# Altium schematic sheet 30_Power1.SchDoc: Board power supply 1
size A3; Organization: Lime Microsystems; Address1: Surrey Tech Centre; Address2: Guildford GU2 7YG; Address3: Surrey; Address4: United Kingdom; Revision: v1.1; SheetNumber: 30; SheetTotal: 31
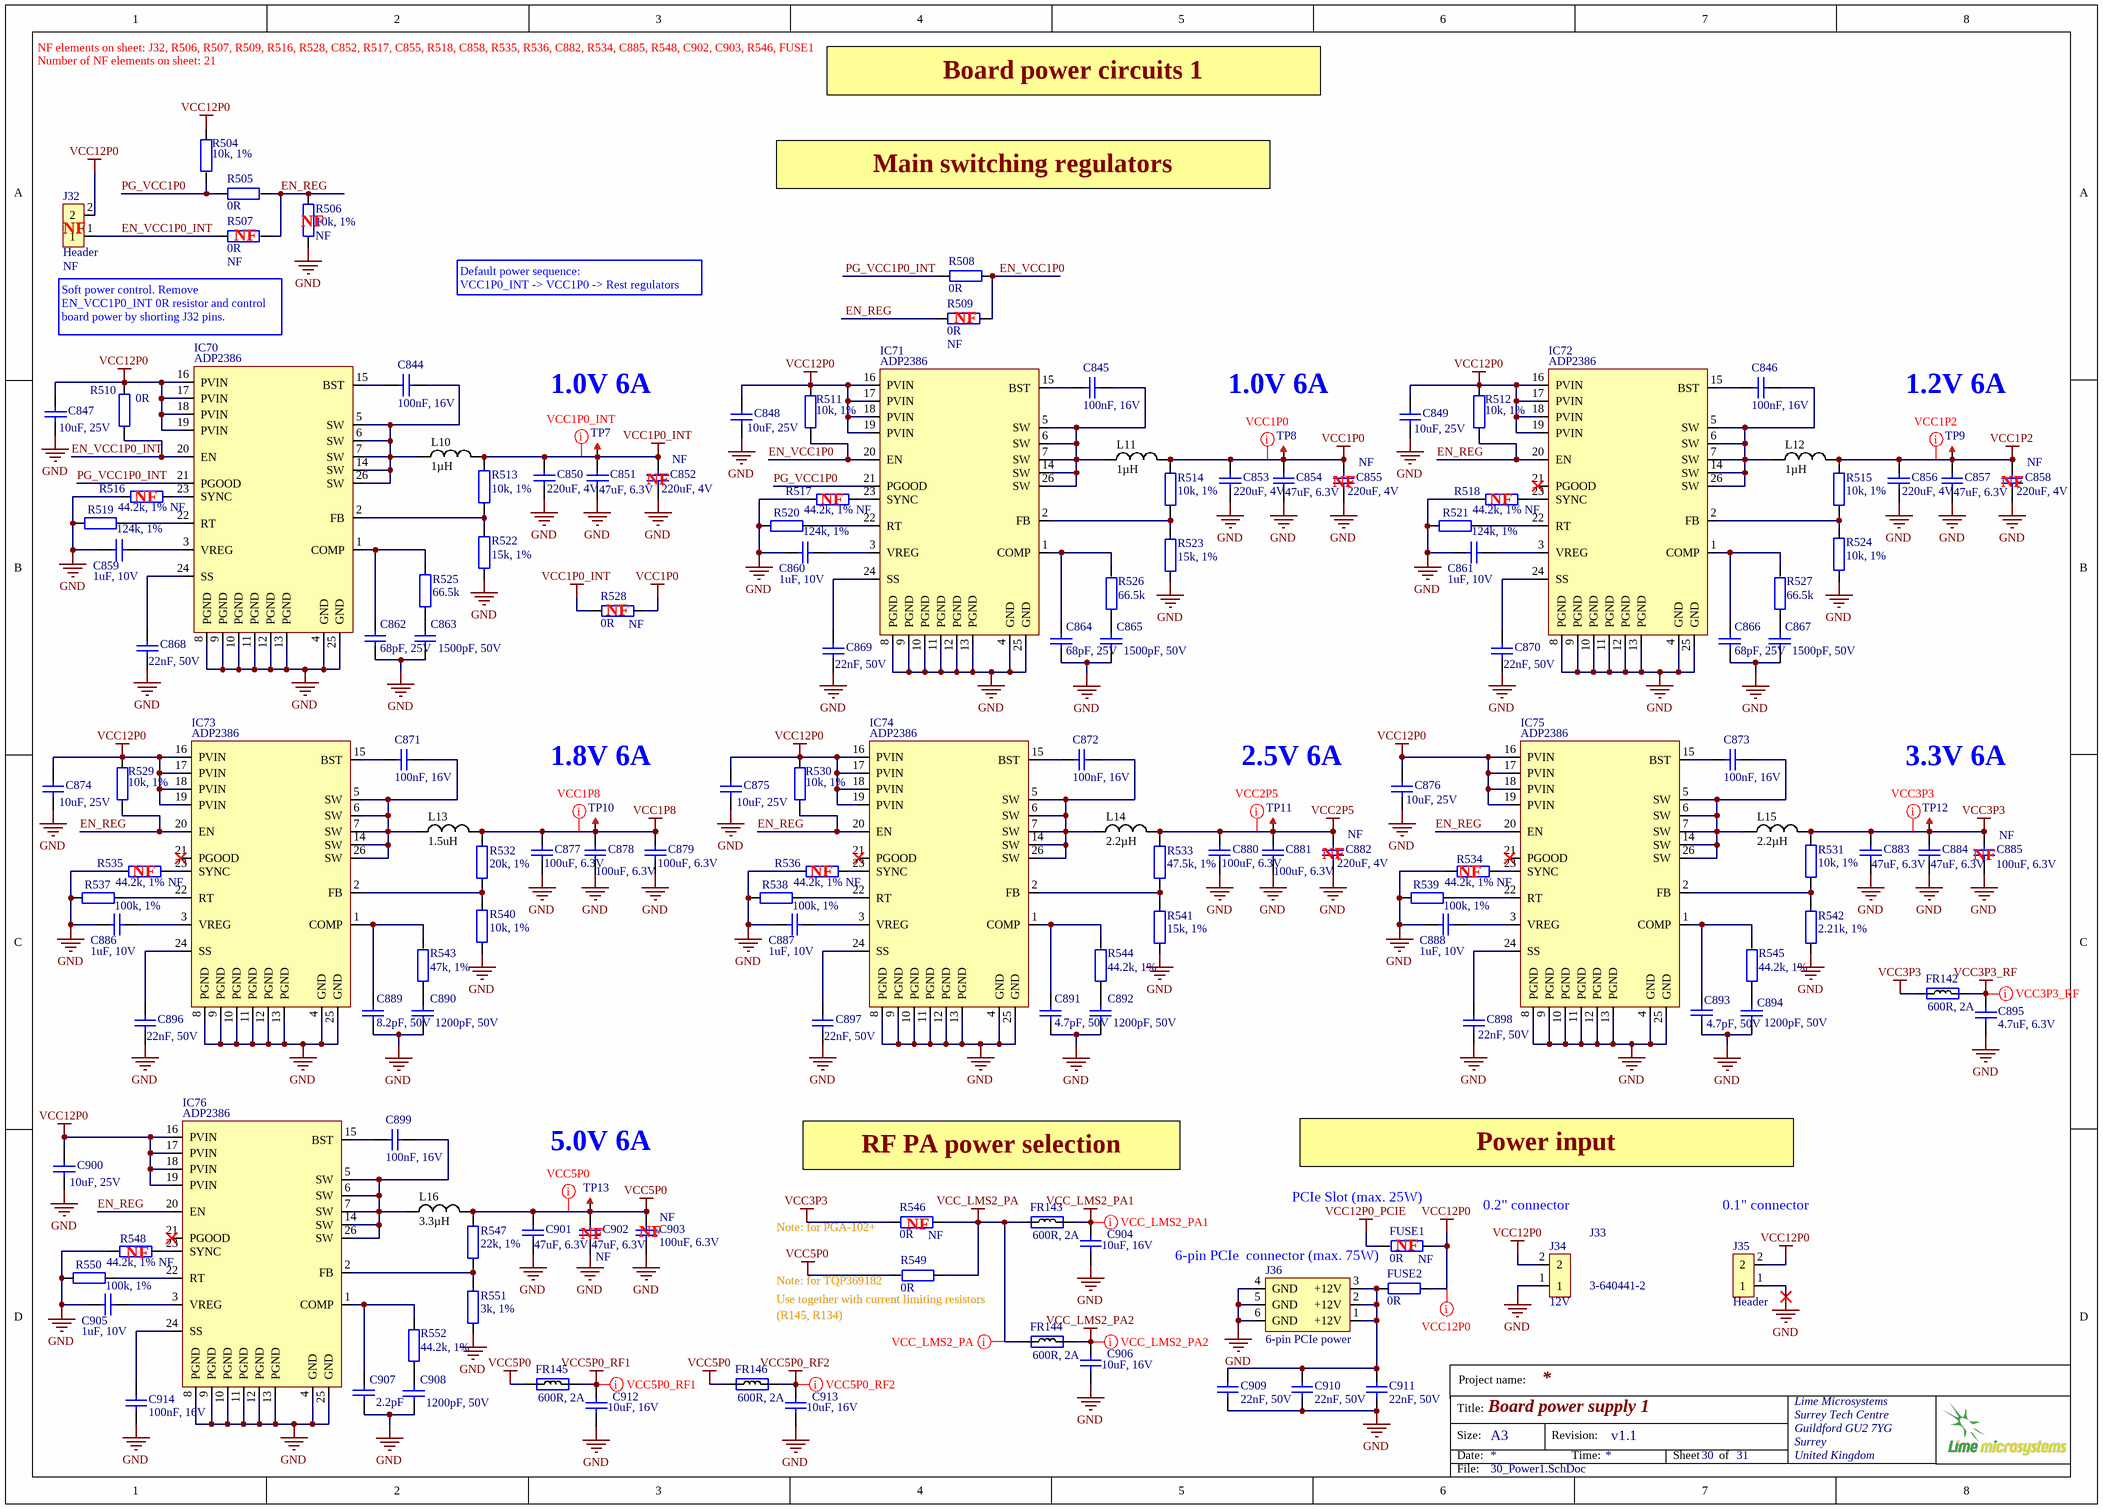
[diagram p0: 30_Power1.SchDoc]

## Parts
C844  100nF, 16V  [CAP0402]
C845  100nF, 16V  [CAP0402]
C846  100nF, 16V  [CAP0402]
C847  10uF, 25V  [CAP0805]
C848  10uF, 25V  [CAP0805]
C849  10uF, 25V  [CAP0805]
C850  220uF, 4V  [CAP1206]
C851  47uF, 6.3V  [CAP1206]
C852  220uF, 4V  Assembly Info: NF  [CAP1206]
C853  220uF, 4V  [CAP1206]
C854  47uF, 6.3V  [CAP1206]
C855  220uF, 4V  Assembly Info: NF  [CAP1206]
C856  220uF, 4V  [CAP1206]
C857  47uF, 6.3V  [CAP1206]
C858  220uF, 4V  Assembly Info: NF  [CAP1206]
C859  1uF, 10V  [CAP0402]
C860  1uF, 10V  [CAP0402]
C861  1uF, 10V  [CAP0402]
C862  68pF, 25V  [CAP0402]
C863  1500pF, 50V  [CAP0402]
C864  68pF, 25V  [CAP0402]
C865  1500pF, 50V  [CAP0402]
C866  68pF, 25V  [CAP0402]
C867  1500pF, 50V  [CAP0402]
C868  22nF, 50V  [CAP0402]
C869  22nF, 50V  [CAP0402]
C870  22nF, 50V  [CAP0402]
C871  100nF, 16V  [CAP0402]
C872  100nF, 16V  [CAP0402]
C873  100nF, 16V  [CAP0402]
C874  10uF, 25V  [CAP0805]
C875  10uF, 25V  [CAP0805]
C876  10uF, 25V  [CAP0805]
C877  100uF, 6.3V  [CAP1206]
C878  100uF, 6.3V  [CAP1206]
C879  100uF, 6.3V  [CAP1206]
C880  100uF, 6.3V  [CAP1206]
C881  100uF, 6.3V  [CAP1206]
C882  220uF, 4V  Assembly Info: NF  [CAP1206]
C883  47uF, 6.3V  [CAP1206]
C884  47uF, 6.3V  [CAP1206]
C885  100uF, 6.3V  Assembly Info: NF  [CAP1206]
C886  1uF, 10V  [CAP0402]
C887  1uF, 10V  [CAP0402]
C888  1uF, 10V  [CAP0402]
C889  8.2pF, 50V  [CAP0402]
C890  1200pF, 50V  [CAP0402]
C891  4.7pF, 50V  [CAP0402]
C892  1200pF, 50V  [CAP0402]
C893  4.7pF, 50V  [CAP0402]
C894  1200pF, 50V  [CAP0402]
C895  4.7uF, 6.3V  [CAP0402]
C896  22nF, 50V  [CAP0402]
C897  22nF, 50V  [CAP0402]
C898  22nF, 50V  [CAP0402]
C899  100nF, 16V  [CAP0402]
C900  10uF, 25V  [CAP0805]
C901  47uF, 6.3V  [CAP1206]
C902  47uF, 6.3V  Assembly Info: NF  [CAP1206]
C903  100uF, 6.3V  Assembly Info: NF  [CAP1206]
C904  10uF, 16V  [CAP0603]
C905  1uF, 10V  [CAP0402]
C906  10uF, 16V  [CAP0603]
C907  2.2pF  [CAP0402]
C908  1200pF, 50V  [CAP0402]
C909  22nF, 50V  [CAP0402]
C910  22nF, 50V  [CAP0402]
C911  22nF, 50V  [CAP0402]
C912  10uF, 16V  [CAP0603]
C913  10uF, 16V  [CAP0603]
C914  100nF, 16V  [CAP0402]
FR142  600R, 2A  [RES0805]
FR143  600R, 2A  [RES0805]
FR144  600R, 2A  [RES0805]
FR145  600R, 2A  [RES0805]
FR146  600R, 2A  [RES0805]
FUSE1  0R  Assembly Info: NF  [RES0805]
FUSE2  0R  [RES0805]
IC70  ADP2386  [ADP2386]
IC71  ADP2386  [ADP2386]
IC72  ADP2386  [ADP2386]
IC73  ADP2386  [ADP2386]
IC74  ADP2386  [ADP2386]
IC75  ADP2386  [ADP2386]
IC76  ADP2386  [ADP2386]
J32  Header  Assembly Info: NF  [HDR_1x2]
J33  3-640441-2  (mechanical)
J34  12V  [1744037-2_CONNECTOR_1X2]
J35  Header  [HDR_1x2]
J36  6-pin PCIe power  [PCIe_POWER_HEADER_6PIN]
L10  1µH  [FDVE1040_TOKO_INDUCTOR]
L11  1µH  [FDVE1040_TOKO_INDUCTOR]
L12  1µH  [FDVE1040_TOKO_INDUCTOR]
L13  1.5uH  [FDVE1040_TOKO_INDUCTOR]
L14  2.2µH  [FDVE1040_TOKO_INDUCTOR]
L15  2.2µH  [FDVE1040_TOKO_INDUCTOR]
L16  3.3µH  [FDVE1040_TOKO_INDUCTOR]
R504  10k, 1%  [RES0402]
R505  0R  [RES0402]
R506  10k, 1%  Assembly Info: NF  [RES0402]
R507  0R  Assembly Info: NF  [RES0402]
R508  0R  [RES0402]
R509  0R  Assembly Info: NF  [RES0402]
R510  0R  [RES0402]
R511  10k, 1%  [RES0402]
R512  10k, 1%  [RES0402]
R513  10k, 1%  [RES0402]
R514  10k, 1%  [RES0402]
R515  10k, 1%  [RES0402]
R516  44.2k, 1%  Assembly Info: NF  [RES0402]
R517  44.2k, 1%  Assembly Info: NF  [RES0402]
R518  44.2k, 1%  Assembly Info: NF  [RES0402]
R519  124k, 1%  [RES0402]
R520  124k, 1%  [RES0402]
R521  124k, 1%  [RES0402]
R522  15k, 1%  [RES0402]
R523  15k, 1%  [RES0402]
R524  10k, 1%  [RES0402]
R525  66.5k  [RES0402]
R526  66.5k  [RES0402]
R527  66.5k  [RES0402]
R528  0R  Assembly Info: NF  [RES0805]
R529  10k, 1%  [RES0402]
R530  10k, 1%  [RES0402]
R531  10k, 1%  [RES0402]
R532  20k, 1%  [RES0402]
R533  47.5k, 1%  [RES0402]
R534  44.2k, 1%  Assembly Info: NF  [RES0402]
R535  44.2k, 1%  Assembly Info: NF  [RES0402]
R536  44.2k, 1%  Assembly Info: NF  [RES0402]
R537  100k, 1%  [RES0402]
R538  100k, 1%  [RES0402]
R539  100k, 1%  [RES0402]
R540  10k, 1%  [RES0402]
R541  15k, 1%  [RES0402]
R542  2.21k, 1%  [RES0402]
R543  47k, 1%  [RES0402]
R544  44.2k, 1%  [RES0402]
R545  44.2k, 1%  [RES0402]
R546  0R  Assembly Info: NF  [RES0805]
R547  22k, 1%  [RES0402]
R548  44.2k, 1%  Assembly Info: NF  [RES0402]
R549  0R  [RES0805]
R550  100k, 1%  [RES0402]
R551  3k, 1%  [RES0402]
R552  44.2k, 1%  [RES0402]
TP7  TESTPOINT_PAD  [TP_PAD_1p5MM]  (value not drawn)  (no BOM)
TP8  TESTPOINT_PAD  [TP_PAD_1p5MM]  (value not drawn)  (no BOM)
TP9  TESTPOINT_PAD  [TP_PAD_1p5MM]  (value not drawn)  (no BOM)
TP10  TESTPOINT_PAD  [TP_PAD_1p5MM]  (value not drawn)  (no BOM)
TP11  TESTPOINT_PAD  [TP_PAD_1p5MM]  (value not drawn)  (no BOM)
TP12  TESTPOINT_PAD  [TP_PAD_1p5MM]  (value not drawn)  (no BOM)
TP13  TESTPOINT_PAD  [TP_PAD_1p5MM]  (value not drawn)  (no BOM)

## Nets
GND: C847.1 C848.1 C849.1 C850.1 C851.1 C852.1 C853.1 C854.1 C855.1 C856.1 C857.1 C858.1 C859.2 C860.2 C861.2 C862.2 C863.2 C864.2 C865.2 C866.2 C867.2 C868.2 C869.2 C870.2 C874.1 C875.1 C876.1 C877.1 C878.1 C879.1 C880.1 C881.1 C882.1 C883.1 C884.1 C885.1 C886.2 C887.2 C888.2 C889.2 C890.2 C891.2 C892.2 C893.2 C894.2 C895.1 C896.2 C897.2 C898.2 C900.1 C901.1 C902.1 C903.1 C904.1 C905.2 C906.1 C907.2 C908.2 C909.2 C910.2 C911.2 C912.1 C913.1 C914.1 IC70.4(GND) IC70.8(PGND) IC70.9(PGND) IC70.10(PGND) IC70.11(PGND) IC70.12(PGND) IC70.13(PGND) IC70.25(GND) IC71.4(GND) IC71.8(PGND) IC71.9(PGND) IC71.10(PGND) IC71.11(PGND) IC71.12(PGND) IC71.13(PGND) IC71.25(GND) IC72.4(GND) IC72.8(PGND) IC72.9(PGND) IC72.10(PGND) IC72.11(PGND) IC72.12(PGND) IC72.13(PGND) IC72.25(GND) IC73.4(GND) IC73.8(PGND) IC73.9(PGND) IC73.10(PGND) IC73.11(PGND) IC73.12(PGND) IC73.13(PGND) IC73.25(GND) IC74.4(GND) IC74.8(PGND) IC74.9(PGND) IC74.10(PGND) IC74.11(PGND) IC74.12(PGND) IC74.13(PGND) IC74.25(GND) IC75.4(GND) IC75.8(PGND) IC75.9(PGND) IC75.10(PGND) IC75.11(PGND) IC75.12(PGND) IC75.13(PGND) IC75.25(GND) IC76.4(GND) IC76.8(PGND) IC76.9(PGND) IC76.10(PGND) IC76.11(PGND) IC76.12(PGND) IC76.13(PGND) IC76.25(GND) J34.1 J35.1 J36.4(GND) J36.5(GND) J36.6(GND) R506.2 R516.2 R517.2 R518.2 R519.2 R520.2 R521.2 R522.1 R523.1 R524.2 R534.2 R535.2 R536.2 R537.2 R538.2 R539.2 R540.2 R541.1 R542.1 R548.2 R550.2 R551.1
VCC1P0: C853.2 C854.2 C855.2 L11.2 R514.1 R528.1 TP8.1
VCC1P0_INT: C850.2 C851.2 C852.2 L10.2 R513.1 R528.2 TP7.1
VCC1P2: C856.2 C857.2 C858.2 L12.2 R515.1 TP9.1
VCC1P8: C877.2 C878.2 C879.2 L13.2 R532.2 TP10.1
VCC2P5: C880.2 C881.2 C882.2 L14.2 R533.2 TP11.1
VCC3P3: C883.2 C884.2 C885.2 FR142.1 L15.2 R531.1 R546.2 TP12.1
VCC3P3_RF: C895.2 FR142.2
VCC5P0: C901.2 C902.2 C903.2 FR145.1 FR146.1 L16.2 R547.2 R549.2 TP13.1
VCC5P0_RF1: C912.2 FR145.2
VCC5P0_RF2: C913.2 FR146.2
VCC12P0: C847.2 C848.2 C849.2 C874.2 C875.2 C876.2 C900.2 FUSE1.1 FUSE2.1 IC70.16(PVIN) IC70.17(PVIN) IC70.18(PVIN) IC70.19(PVIN) IC71.16(PVIN) IC71.17(PVIN) IC71.18(PVIN) IC71.19(PVIN) IC72.16(PVIN) IC72.17(PVIN) IC72.18(PVIN) IC72.19(PVIN) IC73.16(PVIN) IC73.17(PVIN) IC73.18(PVIN) IC73.19(PVIN) IC74.16(PVIN) IC74.17(PVIN) IC74.18(PVIN) IC74.19(PVIN) IC75.16(PVIN) IC75.17(PVIN) IC75.18(PVIN) IC75.19(PVIN) IC76.16(PVIN) IC76.17(PVIN) IC76.18(PVIN) IC76.19(PVIN) J32.2 J34.2 J35.2 R504.1 R510.2 R511.1 R512.1 R529.1 R530.1
VCC12P0_PCIE: FUSE1.2
VCC_LMS2_PA: FR143.1 FR144.1 R546.1 R549.1
VCC_LMS2_PA1: C904.2 FR143.2
VCC_LMS2_PA2: C906.2 FR144.2
EN_REG: IC72.20(EN) IC73.20(EN) IC74.20(EN) IC75.20(EN) IC76.20(EN) R505.2 R506.1 R507.2 R509.1 R512.2 R529.2 R530.2
EN_VCC1P0: IC71.20(EN) R508.1 R509.2 R511.2
EN_VCC1P0_INT: IC70.20(EN) J32.1 R507.1 R510.1
PG_VCC1P0: IC71.21(PGOOD) R504.2 R505.1
PG_VCC1P0_INT: IC70.21(PGOOD) R508.2
NetC844_1: C844.1 IC70.15(BST)
NetC844_2: C844.2 IC70.5(SW) IC70.6(SW) IC70.7(SW) IC70.14(SW) IC70.26(SW) L10.1
NetC845_1: C845.1 IC71.15(BST)
NetC845_2: C845.2 IC71.5(SW) IC71.6(SW) IC71.7(SW) IC71.14(SW) IC71.26(SW) L11.1
NetC846_1: C846.1 IC72.15(BST)
NetC846_2: C846.2 IC72.5(SW) IC72.6(SW) IC72.7(SW) IC72.14(SW) IC72.26(SW) L12.1
NetC859_1: C859.1 IC70.3(VREG)
NetC860_1: C860.1 IC71.3(VREG)
NetC861_1: C861.1 IC72.3(VREG)
NetC862_1: C862.1 IC70.1(COMP) R525.2
NetC863_1: C863.1 R525.1
NetC864_1: C864.1 IC71.1(COMP) R526.2
NetC865_1: C865.1 R526.1
NetC866_1: C866.1 IC72.1(COMP) R527.2
NetC867_1: C867.1 R527.1
NetC868_1: C868.1 IC70.24(SS)
NetC869_1: C869.1 IC71.24(SS)
NetC870_1: C870.1 IC72.24(SS)
NetC871_1: C871.1 IC73.15(BST)
NetC871_2: C871.2 IC73.5(SW) IC73.6(SW) IC73.7(SW) IC73.14(SW) IC73.26(SW) L13.1
NetC872_1: C872.1 IC74.15(BST)
NetC872_2: C872.2 IC74.5(SW) IC74.6(SW) IC74.7(SW) IC74.14(SW) IC74.26(SW) L14.1
NetC873_1: C873.1 IC75.15(BST)
NetC873_2: C873.2 IC75.5(SW) IC75.6(SW) IC75.7(SW) IC75.14(SW) IC75.26(SW) L15.1
NetC886_1: C886.1 IC73.3(VREG)
NetC887_1: C887.1 IC74.3(VREG)
NetC888_1: C888.1 IC75.3(VREG)
NetC889_1: C889.1 IC73.1(COMP) R543.2
NetC890_1: C890.1 R543.1
NetC891_1: C891.1 IC74.1(COMP) R544.2
NetC892_1: C892.1 R544.1
NetC893_1: C893.1 IC75.1(COMP) R545.2
NetC894_1: C894.1 R545.1
NetC896_1: C896.1 IC73.24(SS)
NetC897_1: C897.1 IC74.24(SS)
NetC898_1: C898.1 IC75.24(SS)
NetC899_1: C899.1 IC76.15(BST)
NetC899_2: C899.2 IC76.5(SW) IC76.6(SW) IC76.7(SW) IC76.14(SW) IC76.26(SW) L16.1
NetC905_1: C905.1 IC76.3(VREG)
NetC907_1: C907.1 IC76.1(COMP) R552.2
NetC908_1: C908.1 R552.1
NetC909_1: C909.1 C910.1 C911.1 FUSE2.2 J36.1(+12V) J36.2(+12V) J36.3(+12V)
NetC914_2: C914.2 IC76.24(SS)
NetIC70_2: IC70.2(FB) R513.2 R522.2
NetIC70_22: IC70.22(RT) R519.1
NetIC70_23: IC70.23(SYNC) R516.1
NetIC71_2: IC71.2(FB) R514.2 R523.2
NetIC71_22: IC71.22(RT) R520.1
NetIC71_23: IC71.23(SYNC) R517.1
NetIC72_2: IC72.2(FB) R515.2 R524.1
NetIC72_22: IC72.22(RT) R521.1
NetIC72_23: IC72.23(SYNC) R518.1
NetIC73_2: IC73.2(FB) R532.1 R540.1
NetIC73_22: IC73.22(RT) R537.1
NetIC73_23: IC73.23(SYNC) R535.1
NetIC74_2: IC74.2(FB) R533.1 R541.2
NetIC74_22: IC74.22(RT) R538.1
NetIC74_23: IC74.23(SYNC) R536.1
NetIC75_2: IC75.2(FB) R531.2 R542.2
NetIC75_22: IC75.22(RT) R539.1
NetIC75_23: IC75.23(SYNC) R534.1
NetIC76_2: IC76.2(FB) R547.1 R551.2
NetIC76_22: IC76.22(RT) R550.1
NetIC76_23: IC76.23(SYNC) R548.1

Not connected (* = marked no-connect by the designer): IC72 21(PGOOD)*; IC73 21(PGOOD)*; IC74 21(PGOOD)*; IC75 21(PGOOD)*; IC76 21(PGOOD)*

## Layout directives
net class VCC1P0_INT: VCC1P0_INT
net class VCC5P0: VCC5P0
net class VCC1P0: VCC1P0
net class VCC2P5: VCC2P5
net class VCC1P2: VCC1P2
net class VCC1P8: VCC1P8
net class VCC3P3: VCC3P3
net class VCC3P3_RF: VCC3P3_RF
net class VCC12P0: VCC12P0
net class VCC5P0_RF1: VCC5P0_RF1
net class VCC5P0_RF2: VCC5P0_RF2
net class VCC_LMS2_PA: VCC_LMS2_PA
net class VCC_LMS2_PA1: VCC_LMS2_PA1
net class VCC_LMS2_PA2: VCC_LMS2_PA2

## Notes on the sheet
- Number of NF elements on sheet: 21
- NF elements on sheet: J32, R506, R507, R509, R516, R528, C852, R517, C855, R518, C858, R535, R536, C882, R534, C885, R548, C902, C903, R546, FUSE1
- Board power circuits 1
- (near J32) NF
- (near R507) NF
- (near R506) NF
- Main switching regulators
- Default power sequence:
  VCC1P0_INT -> VCC1P0 -> Rest regulators
- Soft power control. Remove EN_VCC1P0_INT 0R resistor and control board power by shorting J32 pins.
- (near R509) NF
- (near TP7) 1.0V 6A
- (near TP8) 1.0V 6A
- (near TP9) 1.2V 6A
- (near R516) NF
- (near C852) NF
- (near R517) NF
- (near C855) NF
- (near R518) NF
- (near C858) NF
- (near R528) NF
- (near TP10) 1.8V 6A
- 2.5V 6A
- (near TP12) 3.3V 6A
- (near R535) NF
- (near R536) NF
- (near C882) NF
- (near R534) NF
- (near C885) NF
- (near TP13) 5.0V 6A
- RF PA power selection
- Power input
- (near R548) NF
- (near C902) NF
- (near C903) NF
- (near R546) Note: for PGA-102+
- (near R546) NF
- (near FUSE1) 6-pin PCIe  connector (max. 75W)
- (near FUSE1) PCIe Slot (max. 25W)
- (near FUSE1) NF
- (near J33) 0.2" connector
- (near J35) 0.1" connector
- (near R549) Note: for TQP369182
- (near R549) Use together with current limiting resistors
- (R145, R134)
- Project name:
- Title:
- Size:
- Date:
- A3
- Revision:
- Time:
- Sheet
- of
- File:

## Library data of the parts
C844-C846 C871-C873 C899 C914 = Cap_0402: Manufacturer: Murata Electronics; Manufacturer Part Number 1: GRM155R71C104KA88D; Part Description: 0.10µF ±10% 16V X7R Ceramic Capacitor -55°C ~ 125°C Surface Mount, MLCC 0402 (1005 Metric) 0.039" L x 0.020" W (1.00mm x 0.50mm); Tolerance: 10 %; Type: General Purpose MLCC; Capacitance: 0.1 uF; Case Length: 1 mm; Dielectric: X7R; Case Height: 0.5 mm; Temperature Coefficient / Code: +/- 15 %; Value: 100nF, 16V; Supplier 1: Mouser; Supplier Part Number 1: 81-GRM155R71C104KA88; Case Code - in: 0402; RoHS: RoHS Compliant; Operating Temperature Range: - 55 C to + 125 C; Series: GRM; Termination Style: SMD/SMT; Package / Case: 0402 (1005 metric); Voltage Rating DC: 16 V; Maximum Operating Temperature: + 125 C; Case Code - mm: 1005; Minimum Operating Temperature: - 55 C; Product Category: Low & Medium Capacitance SMD Ceramic Chip Capacitors; Packaging: Reel; Product: General Type MLCCs; Category: Multilayer Ceramic Capacitors MLCC - SMD/SMT; Brand: Murata Electronics; Case Width: 0.5 mm; RoHS - Mouser: Y; Standard Pack Qty: 10000; Minimum Order Quantity: 1; Reeling: True
C847-C849 C874-C876 C900 = Cap_0805: Part Description: 10 µF ±10% 25V Ceramic Capacitor X5R 0805 (2012 Metric); Manufacturer: Yageo; Manufacturer Part Number 1: CC0805KKX5R8BB106; Tolerance: 10%; Dielectric: X5R; Value: 10uF, 25V; Supplier 1: Digi-Key; Supplier Part Number 1: 311-1869-1-ND; Stock 1: 454218; Pricing 1: 1=0,31000, 10=0,21200, 50=0,14820, 100=0,12710, 500=0,09534, 1000=0,08050 (USD); RoHS: Yes; Mount: Surface Mount; Case/Package: 0805; Case Code (Imperial): 0805; Case Code (Metric): 2012; Weight: 0.000194oz; Min Operating Temperature: -55°C; Max Operating Temperature: 85°C; Capacitance: 10uF; Voltage Rating (DC): 25V; Packaging: Tape and Reel; Voltage Rating: 25V; Termination: SMD/SMT; Resistor Type: Ceramic; Series: CC; Length: 0.079inch; Width: 0.049inch; Thickness: 0.057inch; Depth: 1.25mm; Lead Free: Lead Free; Halogen Free: Halogen Free; RoHS Compliant: Yes; ComponentLink1URL: http://www.mouser.com/ds/2/447/UPY-GPHC_X5R_4V-to-50V_25-1131599.pdf?src-supplier=Mouser; ComponentLink1Description: http://www.mouser.com/ds/2/447/UPY-GPHC_X5R_4V-to-50V_25-1131599.pdf?src-supplier=Mouser; ComponentLink2URL: http://www.yageo.com/documents/recent/UPY-GPHC_X5R_4V-to-50V_25.pdf?src-supplier=Digi-Key; ComponentLink2Description: http://www.yageo.com/documents/recent/UPY-GPHC_X5R_4V-to-50V_25.pdf?src-supplier=Digi-Key
C850 C852 C853 C855 C856 C858 C882 = Cap_1206: Manufacturer Part Number 1: GRM31CR60G227ME11L; Manufacturer: Murata Electronics North America; Part Description: 220µF ±20% 4V Ceramic Capacitor X5R 1206 (3216 Metric); Capacitance: 220µF; Temperature Coefficient: X5R; Tolerance: ±20%; Package / Case: 1206 (3216 Metric); Supplier 1: Digi-Key; Packaging: Cut Tape (CT); Size / Dimension: 0.126" L x 0.063" W (3.20mm x 1.60mm); Operating Temperature: -55°C ~ 85°C; Voltage - Rated: 4V; Mounting Type: Surface Mount, MLCC; Ratings: -; Supplier Part Number 1: 490-9774-1-ND; Category: Capacitors; Lead Spacing: -; Lead Style: -; Applications: General Purpose; Features: -; Height - Seated (Max): -; Thickness (Max): 0.075" (1.90mm); RoHS: RoHS Compliant; Value: 220uF, 4V
C851 C854 C857 C883 C884 C901 C902 = Cap_1206: Manufacturer: Samsung Electro-Mechanics; Manufacturer Part Number: CL31A476MQHNNNE; Part Description: 47µF ±20% 6.3V Ceramic Capacitor X5R 1206 (3216 Metric); Notification: Current market demand for these product types have resulted in fluctuating and extending lead times. Lead times may differ.; Temperature Coefficient: X5R; Tolerance: ±20%; Thickness (Max): 0.071" (1.80mm); Height - Seated (Max): -; Operating Temperature: -55°C ~ 85°C; Lead Style: -; Package / Case: 1206 (3216 Metric); Size / Dimension: 0.126" L x 0.063" W (3.20mm x 1.60mm); Applications: General Purpose; Ratings: -; Mounting Type: Surface Mount, MLCC; Voltage - Rated: 6.3V; Lead Spacing: -; Features: -; Supplier Part Number 1: 1276-1167-1-ND; RoHS: RoHS Compliant; Category: Capacitors; Supplier 1: Digi-Key; Packaging: Cut Tape (CT); Part Status: Active; Value: 47uF, 6.3V; Manufacturer Part Number 1: CL31A476MQHNNNE
C859-C861 C886-C888 C905 = Cap_0402: Manufacturer Part Number 1: C1005X5R1E105K050BC; Manufacturer: TDK; Part Description: 1µF ±10% 10V X5R Ceramic Capacitor -55°C ~ 85°C Surface Mount, MLCC 0402 (1005 Metric) 0.039" L x 0.020" W (1.00mm x 0.50mm); Voltage Rating: 10; Capacitance Tolerance: ± 10%; Product Range: TDK - C Series; Ceramic Capacitor Case: 0402 [1005 Metric]; Capacitance: 1; Dielectric Characteristic: X6; Value: 1uF, 10V; Supplier 1: Digi-Key; Supplier Part Number 1: 445-9066-1-ND; MSL: -; RoHS: YES
C862 C864 C866 = Cap_0402: Manufacturer Part Number 1: CBR04C680F3GAC; Manufacturer: Kemet; Part Description: 68pF ±1% 25V Ceramic Capacitor C0G, NP0 0402 (1005 Metric); Temperature Coefficient: C0G, NP0; Tolerance: ±1%; Value: 68pF, 25V; Supplier 1: Digi-Key; Supplier Part Number 1: 399-11255-1-ND; Applications: RF, Microwave, High Frequency; Voltage - Rated: 25V; Capacitance: 68pF; Mounting Type: Surface Mount, MLCC; Package / Case: 0402 (1005 Metric); Features: High Q, Low Loss; Lead Spacing: -; Size / Dimension: 0.039" L x 0.020" W (1.00mm x 0.50mm); Operating Temperature: -55°C ~ 125°C; Packaging: Cut Tape (CT); Thickness (Max): 0.022" (0.55mm); Category: Capacitors; Lead Style: -; Ratings: -; Height - Seated (Max): -; RoHS: RoHS Compliant
C863 C865 C867 = Cap_0402: Manufacturer Part Number 1: CL05B152KB5NNNC; Manufacturer: Samsung Electro-Mechanics America, Inc.; Part Description: 1500pF ±10% 50V Ceramic Capacitor X7R 0402 (1005 Metric); Temperature Coefficient: X7R; Tolerance: ±10%; Value: 1500pF, 50V; Supplier 1: Digi-Key; Supplier Part Number 1: 1276-1521-1-ND; Thickness (Max): 0.022" (0.55mm); Features: -; Category: Capacitors; Size / Dimension: 0.039" L x 0.020" W (1.00mm x 0.50mm); RoHS: RoHS Compliant; Package / Case: 0402 (1005 Metric); Mounting Type: Surface Mount, MLCC; Packaging: Cut Tape (CT); Lead Style: -; Lead Spacing: -; Capacitance: 1500pF; Voltage - Rated: 50V; Applications: General Purpose; Height - Seated (Max): -; Ratings: -; Operating Temperature: -55°C ~ 125°C
C868-C870 C896-C898 C909-C911 = Cap_0402: Manufacturer: Kemet; Manufacturer Part Number 1: C0402C223K5RACTU; Part Description: 0.022µF ±10% 50V Ceramic Capacitor X7R 0402 (1005 Metric); Temperature Coefficient: X7R; Tolerance: ±10%; Capacitance: 0.022µF; Value: 22nF, 50V; Supplier 1: Digi-Key; Supplier Part Number 1: 399-7780-1-ND; Ratings: -; Packaging: Cut Tape (CT); Category: Capacitors; Size / Dimension: 0.039" L x 0.020" W (1.00mm x 0.50mm); RoHS: RoHS Compliant; Operating Temperature: -55°C ~ 125°C; Mounting Type: Surface Mount, MLCC; Applications: General Purpose; Voltage - Rated: 50V; Thickness (Max): 0.022" (0.55mm); Features: -; Height - Seated (Max): -; Lead Style: -; Package / Case: 0402 (1005 Metric); Lead Spacing: -
C877-C881 C885 C903 = Cap_1206: Manufacturer: MURATA; Manufacturer Part Number 1: GRM31CR60J107ME39L.; Part Description: SMD Multilayer Ceramic Capacitor, 1206 [3216 Metric], 100 µF, 6.3 V, ± 20%, X5R, GRM Series; Capacitance Tolerance: ± 20%; Ceramic Capacitor Case: 1206 [3216 Metric]; Voltage Rating: 6.3; value: 100uF, 6.3V; Supplier Part Number 1: 1735535; Supplier 1: Farnell
C889 = Cap_0402: Manufacturer: Samsung; Manufacturer Part Number 1: CL05C8R2DB5NNNC; Part Description: 8.2pF ±0.5pF 50V Ceramic Capacitor C0G, NP0 0402 (1005 Metric); Material: Ceramic; Dielectric: C0G; Value: 8.2pF, 50V; Supplier 1: Digi-Key; Supplier Part Number 1: 1276-1730-1-ND; Stock 1: 852884; Pricing 1: 1=0.1, 10=0.052, 100=0.0233, 500=0.01664, 1000=0.01307, 2500=0.01188, 5000=0.01093 (USD); Mount: Surface Mount; Case/Package: 0402; Case Code (Metric): 1005; Case Code (Imperial): 0402; Min Operating Temperature: -55°C; Max Operating Temperature: 125°C; Package Quantity: 1; Packaging: Tape and Reel; Capacitance: 8.2pF; Voltage Rating: 50V; Voltage Rating (DC): 50V; Length: 1mm; Height: 0.5mm; Width: 0.02inch; Thickness: 0.022inch; Depth: 0.5mm; Radiation Hardening: No; ComponentLink1URL: https://media.digikey.com/pdf/Data%20Sheets/Samsung%20PDFs/CL_Series_MLCC_ds.pdf?src-supplier=Digi-Key; ComponentLink1Description: https://media.digikey.com/pdf/Data%20Sheets/Samsung%20PDFs/CL_Series_MLCC_ds.pdf?src-supplier=Digi-Key; ComponentLink2URL: https://produktinfo.conrad.com/datenblaetter/450000-474999/458790-da-01-en-VS_KONDENSATOR_0402.pdf?src-supplier=Conrad; ComponentLink2Description: https://produktinfo.conrad.com/datenblaetter/450000-474999/458790-da-01-en-VS_KONDENSATOR_0402.pdf?src-supplier=Conrad
C890 C892 C894 C908 = Cap_0402: Manufacturer: Kemet; Manufacturer Part Number 1: C0402C122J5GACTU; Part Description: 1200pF ±5% 50V Ceramic Capacitor C0G, NP0 0402 (1005 Metric); Temperature Coefficient: C0G, NP0; Tolerance: ±5%; Value: 1200pF, 50V; Supplier 1: Digi-Key; Supplier Part Number 1: 399-7334-1-ND; Thickness (Max): 0.022" (0.55mm); Capacitance: 1200pF; Lead Spacing: -; Mounting Type: Surface Mount, MLCC; Package / Case: 0402 (1005 Metric); Category: Capacitors; Size / Dimension: 0.039" L x 0.020" W (1.00mm x 0.50mm); Voltage - Rated: 50V; Lead Style: -; Ratings: -; Features: -; Packaging: Cut Tape (CT); RoHS: RoHS Compliant; Operating Temperature: -55°C ~ 125°C; Applications: General Purpose; Height - Seated (Max): -
C891 C893 = Cap_0402: Manufacturer: MURATA; Manufacturer Part Number 1: GRM1555C1H4R7CA01D; Part Description: 4.7pF ±0.25pF 50V Ceramic Capacitor C0G, NP0 0402 (1005 Metric); Capacitance Tolerance: ± 0.25; Voltage Rating: 50; Dielectric Characteristic: C0G / NP0; Ceramic Capacitor Case: 0402 [1005 Metric]; Capacitance: 4.7; SVHC: No SVHC (15-Jun-2015; Product Range: GRM Series; Value: 4.7pF, 50V; Supplier 1: Farnell; Supplier Part Number 1: 2434644; Operating Temperature Max: 125; Operating Temperature Min: -55; MSL: MSL 1 - Unlimited; RoHS: YES; Packaging: Cut Tape
C895 = Cap_0402: Manufacturer: Murata Electronics North America; Manufacturer Part Number 1: GRM155R60J475ME87D; Part Description: 4.7µF ±20% 6.3V X5R Ceramic Capacitor -55°C ~ 85°C Surface Mount, MLCC 0402 (1005 Metric) 0.039" L x 0.020" W (1.00mm x 0.50mm); Tolerance: ±20%; Capacitance: 4.7µF; Temperature Coefficient: X5R; Lead Style: -; Ratings: -; Height - Seated (Max): -; Thickness (Max): 0.022" (0.55mm); Voltage - Rated: 6.3V; Packaging: Cut Tape (CT); Lead Spacing: -; Category: Capacitors; Supplier Part Number 1: 490-5408-1-ND; Applications: General Purpose; Operating Temperature: -55°C ~ 85°C; Mounting Type: Surface Mount, MLCC; Features: Derating Recommended; RoHS: RoHS Compliant; Supplier 1: Digi-Key; Package / Case: 0402 (1005 Metric); Size / Dimension: 0.039" L x 0.020" W (1.00mm x 0.50mm); Value: 4.7uF, 6.3V
C904 C906 C912 C913 = Cap_0603: Manufacturer: Yageo; Manufacturer Part Number 1: GRM188R61C106MA73D; Part Description: 10µF ±20% 16V Ceramic Capacitor X5R 0603 (1608 Metric); Temperature Coefficient: X5R; Capacitance: 10µF; Tolerance: ±20%; Value: 10uF, 16V; Supplier 1: Digi-Key; Supplier Part Number 1: 490-7201-2-ND; Category: Capacitors; Ratings: -; Features: -; Lead Style: -; Package / Case: 0603 (1608 Metric); Lead Spacing: -; Applications: General Purpose; Voltage - Rated: 16V; Operating Temperature: -55°C ~ 85°C; Thickness (Max): 0.039" (1.00mm); Mounting Type: Surface Mount, MLCC; RoHS: RoHS Compliant; Size / Dimension: 0.063" L x 0.031" W (1.60mm x 0.80mm); Packaging: Tape & Reel (TR); Height - Seated (Max): -
C907 = Cap_0402: Manufacturer Part Number 1: CL05C2R2CB5NNNC; Manufacturer: Samsung Electro-Mechanics America, Inc.; Part Description: 2.2pF ±0.25pF 50V Ceramic Capacitor C0G, NP0 0402 (1005 Metric); Voltage - Rated: 50V; Temperature Coefficient: C0G, NP0; Tolerance: ±0.25pF; Value: 2.2pF; Lead Spacing: -; Applications: General Purpose; Supplier 1: Digi-Key; Thickness (Max): 0.022" (0.55mm); Operating Temperature: -55°C ~ 125°C; Size / Dimension: 0.039" L x 0.020" W (1.00mm x 0.50mm); Mounting Type: Surface Mount, MLCC; Features: -; Capacitance: 2.2pF; Lead Style: -; Supplier Part Number 1: 1276-1271-1-ND; Height - Seated (Max): -; Package / Case: 0402 (1005 Metric); Category: Capacitors; Packaging: Cut Tape (CT); Ratings: -; RoHS: RoHS Compliant
FR142-FR146 = Ferrite: Manufacturer Part Number 1: MPZ2012S601AT000; Manufacturer: TDK Corporation; Part Description: FERRITE BEAD 600 OHM 0805 1LN; Filter Type: Differential Mode - Single; Impedance @ Frequency: 600 Ohm @ 100MHz; DC Resistance (DCR): 100 mOhm Max; Supplier 1: Digi-Key; Supplier Part Number 1: 445-2206-2-ND; Mounting Type: Surface Mount; RoHS: RoHS Compliant; Height (Max): 0.041" (1.05mm); Packaging: Tape & Reel (TR); Category: Filters; Current Rating: 2A; Package / Case: 0805 (2012 Metric); Size / Dimension: 0.079" L x 0.049" W (2.00mm x 1.25mm); Value: 600R, 2A
FUSE1 FUSE2 R528 R546 R549 = Res_0402: Manufacturer Part Number 1: CRCW08050000Z0EA; Manufacturer: Vishay Dale; Part Description: RES SMD 0.0 OHM JUMPER 1/8W 0805; Power (Watts): 0.125W, 1/8W; Resistance (Ohms): 0.0; Tolerance: Jumper; Value: 0R; Supplier 1: Digi-Key; Supplier Part Number 1: 541-0.0ATR-ND; Package / Case: 0805 (2012 Metric); Height: 0.020" (0.50mm); Packaging: Tape & Reel (TR); Operating Temperature: -55°C ~ 155°C; Temperature Coefficient: -; RoHS: RoHS Compliant; Size / Dimension: 0.079" L x 0.049" W (2.00mm x 1.25mm); Supplier Device Package: 0805 (2012 Metric); Number of Terminations: 2; Category: Resistors; Features: Automotive AEC-Q200; Composition: Thick Film
IC70-IC76 = ADP2386: Manufacturer: Analog Devices Inc.; Part Description: Buck Switching Regulator IC Positive Adjustable 0.6V 1 Output 6A 24-WFQFN Exposed Pad, CSP; Manufacturer Part Number 1: ADP2386ACPZN-R7; Function: Step-Down; Voltage - Output (Max): 18V; Synchronous Rectifier: Yes; Output Configuration: Positive; Frequency - Switching: 200kHz ~ 1.4MHz; Number of Outputs: 1; Output Type: Adjustable; Topology: Buck; Voltage - Input (Min): 4.5V; Voltage - Output (Min/Fixed): 0.6V; Voltage - Input (Max): 20V; Current - Output: 6A; Supplier 1: Digi-Key; Packaging: Digi-Reel®; RoHS: RoHS Compliant; Package / Case: 24-WFQFN Exposed Pad, CSP; Operating Temperature: -40°C ~ 125°C (TJ); Supplier Device Package: 24-LFCSP-WQ (4x4); Mounting Type: Surface Mount; Category: Integrated Circuits (ICs); Supplier Part Number 1: ADP2386ACPZN-R7DKR-ND
J32 J35 = Jumper: Part Description: Connector Header Through Hole 2 position 0.100" (2.54mm); Manufacturer: Wurth Electronics; Manufacturer Part Number 1: 61300211121; Current Rating: 3A; Voltage Rating: 250V; Number of Positions: 2; Gender: Male; Connector Type: Male Pin; Pitch: 0.1inch; ComponentLink1URL: https://cdn.harwin.com/pdfs/60page148.pdf; ComponentLink1Description: https://cdn.harwin.com/pdfs/60page148.pdf; ComponentLink2URL: https://www.verical.com/server-webapp/html/getDatasheet?partID=384167; ComponentLink2Description: https://www.verical.com/server-webapp/html/getDatasheet?partID=384167; ComponentLink3URL: http://www.harwin.com/include/downloads/drawings/M20-996.PDF; ComponentLink3Description: http://www.harwin.com/include/downloads/drawings/M20-996.PDF; Supplier 1: Digi-Key; Supplier Part Number 1: 732-5315-ND; Stock 1: 145436; Pricing 1: 1=0,13000, 10=0,10600, 25=0,08800, 50=0,07400, 100=0,06700, 1000=0,06100 (USD); RoHS: Yes; Mount: Through Hole; Contact Plating: Gold; Housing Material: PBT; Contact Material: Copper Alloy,Copper; Color: Black; Min Operating Temperature: -40°C; Max Operating Temperature: 125°C; Number of Rows: 1; Contact Gender: Male; Packaging: Bulk; Termination: Through Hole; Number of Contacts: 2; Contact Mating Length: 0.236inch; REACH SVHC: Unknown; Lead Free: Lead Free; ComponentLink4URL: https://datasheet.ciiva.com/13619/6130xx11121-48870-13619345.pdf?src-supplier=Mouser; ComponentLink4Description: https://datasheet.ciiva.com/13619/6130xx11121-48870-13619345.pdf?src-supplier=Mouser
J33 = HEADER_RECEPT_3-640441-2: Receptacle for 0.2'' 2 pin connector 640456-2; Manufacturer: AMP - TE CONNECTIVITY; Part Description: 2 Position Rectangular Receptacle Connector IDC Tin 24 AWG; Supplier 1: Digi-Key; Supplier Part Number 1: A30978-ND; Manufacturer Part Number 1: 3-640441-2; Stock 1: 17531; Pricing 1: 1=0,18000, 10=0,17300, 25=0,12880, 50=0,11040, 100=0,10670, 250=0,09204, 500=0,08834, 1000=0,07730, 2500=0,06994 (USD); RoHS: No; ComponentLink1URL: http://www.farnell.com/datasheets/2043229.pdf?src-supplier=Farnell; ComponentLink1Description: http://www.farnell.com/datasheets/2043229.pdf?src-supplier=Farnell; ComponentLink2URL: https://media.digikey.com/pdf/Data%20Sheets/Tyco%20Electonics%20AMP%20PDFs/640441_Dwg.pdf?src-supplier=Digi-Key; ComponentLink2Description: https://media.digikey.com/pdf/Data%20Sheets/Tyco%20Electonics%20AMP%20PDFs/640441_Dwg.pdf?src-supplier=Digi-Key
J34 = Jumper: Manufacturer Part Number 1: 1744037-2; Part Description: Connector Header Through Hole 2 position 0.200" (5.08mm); Manufacturer: TE Connectivity AMP Connectors; Connector Type: Header, Shrouded, 1 Wall; Supplier 1: Digi-Key; Contact Type: Male Pin; Color: White; Mounting Type: Through Hole; Category: Connectors, Interconnects; Contact Finish: Tin; Supplier Part Number 1: A112698-ND
J36 = PCIe_PWR_HEADER_6PIN: Manufacturer Part Number 1: 0455580003; Manufacturer: Molex Connector Corporation; Part Description: 6 Positions Header, Shrouded Connector 0.165" (4.20mm) Through Hole, Right Angle Tin; Number of Positions Loaded: All; Pitch: 0.165" (4.20mm); Number of Positions: 6; Connector Type: Header, Shrouded; Supplier 1: Digi-Key; Contact Finish: Tin; Contact Finish Thickness: 100µin (2.54µm); Fastening Type: Locking Ramp; RoHS: RoHS Compliant; Contact Type: Male Pin; Features: Board Lock; Color: Black; Packaging: Tray; Mounting Type: Through Hole, Right Angle; Category: Connectors, Interconnects; Contact Mating Length: -; Row Spacing: 0.165" (4.20mm); Termination: Solder; Number of Rows: 2; Supplier Part Number 1: WM10869-ND
L10-L12 = Inductor_0603: Manufacturer: Vishay Dale; Manufacturer Part Number 1: IHLP3232DZER1R0M01; Part Description: 1µH Shielded Molded Inductor 18A 5.78 mOhm Max Nonstandard; Tolerance: ±20%; Frequency - Test: 100kHz; DC Resistance (DCR): 5.78 mOhm Max; Frequency - Self Resonant: 42MHz; Shielding: Shielded; Current - Saturation: 24A; Current Rating: 18A; Type: Molded; value: 1µH; Supplier 1: Digi-Key; Supplier Part Number 1: 541-1371-6-ND; Supplier Device Package: -; Packaging: Digi-Reel®; Inductance: 1µH; Height - Seated (Max): 0.158" (4.00mm); RoHS: RoHS Compliant; Size / Dimension: 0.340" L x 0.322" W (8.64mm x 8.18mm); Category: Inductors, Coils, Chokes; Mounting Type: Surface Mount; Material - Core: -; Package / Case: Nonstandard; Q @ Freq: -; Operating Temperature: -55°C ~ 125°C
L13 = Inductor_0603: Manufacturer: Vishay Dale; Manufacturer Part Number 1: IHLP4040DZER1R5M01; Part Description: FIXED IND 1.5UH 15A 5.8 MOHM SMD; DC Resistance (DCR): 5.8 mOhm Max; Inductance: 1.5µH; Shielding: Shielded; Type: Molded; Current Rating: 15A; Frequency - Test: 100kHz; Current - Saturation: 27.5A; Tolerance: ±20%; Value: 1.5uH; Supplier 1: Digi-Key; Supplier Part Number 1: 541-1301-6-ND; Package / Case: Nonstandard; Q @ Freq: -; Packaging: Digi-Reel®; Material - Core: -; Category: Inductors, Coils, Chokes; Frequency - Self Resonant: -; Height - Seated (Max): 0.158" (4.00mm); Supplier Device Package: -; RoHS: RoHS Compliant; Size / Dimension: 0.430" L x 0.405" W (10.92mm x 10.30mm); Mounting Type: Surface Mount; Operating Temperature: -55°C ~ 125°C
L14 L15 = Inductor_0603: Manufacturer Part Number 1: IHLP4040DZER2R2M01; Manufacturer: Vishay Dale; Part Description: 2.2µH Shielded Molded Inductor 12A 9 mOhm Max Nonstandard; Type: Molded; Current Rating: 12A; Frequency - Test: 100kHz; Current - Saturation: 25.6A; DC Resistance (DCR): 9 mOhm Max; Shielding: Shielded; Tolerance: ±20%; Supplier 1: Digi-Key; Supplier Part Number 1: 541-1299-1-ND; Package / Case: Nonstandard; Material - Core: -; Size / Dimension: 0.430" L x 0.405" W (10.92mm x 10.30mm); Supplier Device Package: -; Inductance: 2.2µH; Frequency - Self Resonant: -; Packaging: Cut Tape (CT); Height - Seated (Max): 0.158" (4.00mm); Category: Inductors, Coils, Chokes; RoHS: RoHS Compliant; Mounting Type: Surface Mount; Operating Temperature: -55°C ~ 125°C; Q @ Freq: -; value: 2.2µH
L16 = Inductor_0603: Manufacturer: Vishay Dale; Manufacturer Part Number 1: IHLP4040DZER3R3M01; Part Description: 3.3µH Shielded Molded Inductor 10A 14.4 mOhm Max Nonstandard; DC Resistance (DCR): 14.4 mOhm Max; Shielding: Shielded; Type: Molded; Current Rating: 10A; Frequency - Test: 100kHz; Current - Saturation: 18.6A; Tolerance: ±20%; value: 3.3µH; Package / Case: Nonstandard; Q @ Freq: -; Supplier 1: Digi-Key; Packaging: Cut Tape (CT); Inductance: 3.3µH; Material - Core: -; Category: Inductors, Coils, Chokes; Frequency - Self Resonant: -; Height - Seated (Max): 0.158" (4.00mm); Supplier Device Package: -; RoHS: RoHS Compliant; Size / Dimension: 0.430" L x 0.405" W (10.92mm x 10.30mm); Mounting Type: Surface Mount; Operating Temperature: -55°C ~ 125°C; Supplier Part Number 1: 541-1298-1-ND
R504 R506 R511-R515 R524 R529-R531 R540 = Res_0402: Manufacturer: Yageo; Manufacturer Part Number 1: RC0402FR-0710KL; Part Description: RES SMD 10K OHM 1% 1/16W 0402; Temperature Coefficient: ±100ppm/°C; Power (Watts): 0.063W, 1/16W; Value: 10k, 1%; Supplier 1: Digi-Key; Supplier Part Number 1: 311-10.0KLRTR-ND; Resistance (Ohms): 10k; Packaging: Tape & Reel (TR); RoHS: RoHS Compliant; Package / Case: 0402 (1005 Metric); Tolerance: ±1%; Operating Temperature: -55°C ~ 155°C; Size / Dimension: 0.039" L x 0.020" W (1.00mm x 0.50mm); Number of Terminations: 2; Category: Resistors; Height: 0.016" (0.40mm); Supplier Device Package: 0402; Features: Moisture Resistant; Composition: Thick Film
R505 R507 R509 = Res_0402: Manufacturer Part Number 1: RC0402JR-070RL; Manufacturer: Yageo; Part Description: RES SMD 0.0OHM JUMPER 1/16W 0402; Resistance (Ohms): 0.0; Tolerance: Jumper; Power (Watts): 0.063W, 1/16W; Value: 0R; Supplier 1: Digi-Key; Supplier Part Number 1: 311-0.0JRTR-ND; Category: Resistors; Temperature Coefficient: -; Features: Moisture Resistant; Supplier Device Package: 0402; Height: 0.016" (0.40mm); Package / Case: 0402 (1005 Metric); Operating Temperature: -55°C ~ 155°C; Size / Dimension: 0.039" L x 0.020" W (1.00mm x 0.50mm); Composition: Thick Film; Packaging: Tape & Reel (TR); Number of Terminations: 2; RoHS: RoHS Compliant
R508 R510 = Res_0402: Manufacturer: Yageo; Part Description: RES SMD 0.0OHM JUMPER 1/16W 0402; Manufacturer Part Number 1: RC0402JR-070RL; Supplier 1: Digi-Key; Supplier Part Number 1: 311-0.0JRTR-ND; Composition: Thick Film; Package / Case: 0402 (1005 Metric); Category: Resistors; Value: 0R
R516-R518 R534-R536 R544 R545 R548 R552 = Res_0402: Manufacturer Part Number 1: ERJ-2RKF4422X; Manufacturer: Panasonic Electronic Components; Part Description: RES SMD 44.2K OHM 1% 1/10W 0402; Power (Watts): 0.1W, 1/10W; Temperature Coefficient: ±100ppm/°C; Value: 44.2k, 1%; Supplier 1: Digi-Key; Supplier Part Number 1: P44.2KLCT-ND; Tolerance: ±1%; Supplier Device Package: 0402; Packaging: Cut Tape (CT); Size / Dimension: 0.039" L x 0.020" W (1.00mm x 0.50mm); Features: Automotive AEC-Q200; Package / Case: 0402 (1005 Metric); Height: 0.016" (0.40mm); Operating Temperature: -55°C ~ 155°C; Number of Terminations: 2; Composition: Thick Film; Resistance (Ohms): 44.2k; RoHS: RoHS Compliant; Category: Resistors
R519-R521 = Res_0402: Manufacturer: Panasonic Electronic Components; Manufacturer Part Number 1: ERJ-2RKF1243X; Part Description: RES SMD 124K OHM 1% 1/10W 0402; Power (Watts): 0.1W, 1/10W; Temperature Coefficient: ±100ppm/°C; Value: 124k, 1%; Supplier 1: Digi-Key; Supplier Part Number 1: P124KLCT-ND; Category: Resistors; Package / Case: 0402 (1005 Metric); Operating Temperature: -55°C ~ 155°C; Tolerance: ±1%; Packaging: Cut Tape (CT); Resistance (Ohms): 124k; Features: Automotive AEC-Q200; Height: 0.016" (0.40mm); Number of Terminations: 2; Supplier Device Package: 0402; Size / Dimension: 0.039" L x 0.020" W (1.00mm x 0.50mm); RoHS: RoHS Compliant; Composition: Thick Film
R522 R523 = Res_0402: Manufacturer: Yageo; Manufacturer Part Number 1: RC0402FR-0715KL; Part Description: 15 kOhms ±1% 0.063W, 1/16W Chip Resistor 0402 (1005 Metric) Moisture Resistant Thick Film; Power Rating: 62.5mW; Resistance: 15kR; Voltage Rating: 50V; Temperature Coefficient: 100ppm/°C; Max Power Dissipation: 63mW; Value: 15k, 1%; Supplier 1: Digi-Key; Supplier Part Number 1: 311-15.0KLRCT-ND; Stock 1: 6338073; Pricing 1: 1=0.1, 10=0.016, 100=0.0067, 1000=0.00301, 2500=0.00261, 5000=0.00215 (USD); Case/Package: 0402; Number of Pins: 2; Weight: 2.3E-05oz; Case Code (Imperial): 0402; Case Code (Metric): 1005; Min Operating Temperature: -55°C; Max Operating Temperature: 155°C; Composition: Thick Film; Tolerance: 1%; Packaging: Tape and Reel; Package Quantity: 1; Termination: SMD/SMT; Number of Terminations: 2; Military Standard: Not; Voltage Rating (DC): 50V; Features: Moisture Resistant; Length: 1mm; Height: 0.016inch; Width: 0.5mm; Depth: 0.5mm; REACH SVHC: No SVHC; Lead Free: Lead Free; ComponentLink1URL: http://www.farnell.com/datasheets/1018594.pdf?src-supplier=Element14; ComponentLink1Description: http://www.farnell.com/datasheets/1018594.pdf?src-supplier=Element14; ComponentLink2URL: http://www.mouser.com/ds/2/447/PYu-RC0402_51_RoHS_L_6_r-8721.pdf?src-supplier=Mouser; ComponentLink2Description: http://www.mouser.com/ds/2/447/PYu-RC0402_51_RoHS_L_6_r-8721.pdf?src-supplier=Mouser; ComponentLink3URL: http://www.yageo.com/documents/recent/PYu-RC_Group_51_RoHS_L_10.pdf?src-supplier=Digi-Key; ComponentLink3Description: http://www.yageo.com/documents/recent/PYu-RC_Group_51_RoHS_L_10.pdf?src-supplier=Digi-Key; ComponentLink4URL: http://www.yageo.com/documents/recent/PYu-RC0402_51_RoHS_L_6_r.pdf?src-supplier=Future+Electronics; ComponentLink4Description: http://www.yageo.com/documents/recent/PYu-RC0402_51_RoHS_L_6_r.pdf?src-supplier=Future+Electronics
R525-R527 = Res_0402: Manufacturer Part Number 1: ERJ-2RKF6652X; Manufacturer: Panasonic Electronic Components; Part Description: RES SMD 66.5K OHM 1% 1/10W 0402; Temperature Coefficient: ±100ppm/°C; Power (Watts): 0.1W, 1/10W; Tolerance: ±1%; Value: 66.5k; Supplier 1: Digi-Key; Supplier Part Number 1: P66.5KLDKR-ND; Packaging: Digi-Reel®; Operating Temperature: -55°C ~ 155°C; Height: 0.016" (0.40mm); Size / Dimension: 0.039" L x 0.020" W (1.00mm x 0.50mm); Number of Terminations: 2; Package / Case: 0402 (1005 Metric); Resistance (Ohms): 66.5k; Category: Resistors; Supplier Device Package: 0402; Features: Automotive AEC-Q200; Composition: Thick Film; RoHS: RoHS Compliant
R532 = Res_0402: Manufacturer: Vishay; Manufacturer Part Number 1: CRCW040220K0FKEDC; Part Description: 20 kOhms ±1% 0.063W, 1/16W Chip Resistor 0402 (1005 Metric)  Thick Film; Power Rating: 62.5mW; Resistance: 20kR; Temperature Coefficient: 100ppm/°C; Value: 20k, 1%; Supplier 1: Digi-Key; Supplier Part Number 1: 541-3969-1-ND; Stock 1: 554825; Pricing 1: 1=0.1, 10=0.032, 100=0.013, 1000=0.00583, 2500=0.00506, 5000=0.00418 (USD); Mount: Surface Mount; Case/Package: SMD/SMT; Contact Plating: Tin; Min Operating Temperature: -55°C; Max Operating Temperature: 155°C; Tolerance: 1%; Composition: Thick Film; Termination: Wraparound; Length: 1mm; Lead Free: Lead Free; ComponentLink1URL: http://www.vishay.com/docs/28773/crcwce3.pdf?src-supplier=Digi-Key; ComponentLink1Description: http://www.vishay.com/docs/28773/crcwce3.pdf?src-supplier=Digi-Key
R533 = Res_0402: Manufacturer Part Number 1: ERJ-2RKF4752X; Manufacturer: Panasonic Electronic Components; Part Description: RES SMD 47.5K OHM 1% 1/10W 0402; Temperature Coefficient: ±100ppm/°C; Power (Watts): 0.1W, 1/10W; Value: 47.5k, 1%; Height: 0.016" (0.40mm); Supplier 1: Digi-Key; Features: Automotive AEC-Q200; Packaging: Cut Tape (CT); Composition: Thick Film; Number of Terminations: 2; Supplier Device Package: 0402; Category: Resistors; Package / Case: 0402 (1005 Metric); Supplier Part Number 1: P47.5KLCT-ND; Size / Dimension: 0.039" L x 0.020" W (1.00mm x 0.50mm); Resistance (Ohms): 47.5k; Operating Temperature: -55°C ~ 155°C; Tolerance: ±1%; RoHS: RoHS Compliant
R537 = Res_0402: Part Description: 100 kOhms ±1% 0.063W, 1/16W Chip Resistor 0402 (1005 Metric) Thick Film; Manufacturer: Vishay; Manufacturer Part Number 1: CRCW0402100KFKEDC; Description: Res Thick Film 0402 100K Ohm 1% 1/16W ±100ppm/°C Molded SMD Paper T/R; Resistance: 100kR; Temperature Coefficient: 100ppm/°C; Max Power Dissipation: 63mW; Value: 100k, 1%; Supplier 1: Digi-Key; Supplier Part Number 1: 541-3960-1-ND; Stock 1: 1751702; Pricing 1: 1=0,1, 10=0,029, 50=0,0162, 100=0,0119, 500=0,00728, 1000=0,00535, 5000=0,00384 (USD); RoHS: Yes; Case/Package: 0402; Case Code (Imperial): 0402; Case Code (Metric): 1005; Min Operating Temperature: -55°C; Max Operating Temperature: 155°C; Tolerance: 1%; Series: CRCW-C; Packaging: Cut Tape; Number of Terminations: 2; Lead Free: Lead Free; RoHS Compliant: Yes; ComponentLink1URL: http://www.vishay.com/docs/28773/crcwce3.pdf?src-supplier=Digi-Key; ComponentLink1Description: http://www.vishay.com/docs/28773/crcwce3.pdf?src-supplier=Digi-Key
R538 R539 R550 = Res_0402: Manufacturer: Vishay; Manufacturer Part Number 1: CRCW0402100KFKEDC; Part Description: 100 kOhms ±1% 0.063W, 1/16W Chip Resistor 0402 (1005 Metric) Thick Film; Max Power Dissipation: 63mW; Resistance: 100kR; Temperature Coefficient: 100ppm/°C; Case/Package: 0402; Case Code (Imperial): 0402; Case Code (Metric): 1005; ComponentLink1Description: http://www.vishay.com/docs/28773/crcwce3.pdf?src-supplier=Digi-Key; ComponentLink1URL: http://www.vishay.com/docs/28773/crcwce3.pdf?src-supplier=Digi-Key; Lead Free: Lead Free; Max Operating Temperature: 155°C; Min Operating Temperature: -55°C; Pricing 1: 1=0,1, 10=0,029, 50=0,0162, 100=0,0119, 500=0,00728, 1000=0,00535, 5000=0,00384 (USD); RoHS Compliant: Yes; Series: CRCW-C; Stock 1: 1751702; Number of Terminations: 2; Packaging: Cut Tape; RoHS: Yes; Supplier 1: Digi-Key; Supplier Part Number 1: 541-3960-1-ND; Tolerance: 1%; Value: 100k, 1%
R541 = Res_0402: Manufacturer: Yageo; Manufacturer Part Number 1: RC0402FR-0715KL; Part Description: RES SMD 15K OHM 1% 1/16W 0402; Temperature Coefficient: ±100ppm/°C; Power (Watts): 0.063W, 1/16W; Value: 15k, 1%; Category: Resistors; Number of Terminations: 2; RoHS: RoHS Compliant; Features: Moisture Resistant; Operating Temperature: -55°C ~ 155°C; Tolerance: ±1%; Composition: Thick Film; Resistance (Ohms): 15k; Failure Rate: -; Height - Seated (Max): 0.016" (0.40mm); Packaging: Cut Tape (CT); Supplier Device Package: 0402; Size / Dimension: 0.039" L x 0.020" W (1.00mm x 0.50mm); Package / Case: 0402 (1005 Metric); Part Status: Active; Supplier 1: Digi-Key; Supplier Part Number 1: 311-15.0KLRCT-ND
R542 = Res_0402: Manufacturer: Stackpole Electronics Inc.; Manufacturer Part Number 1: RMCF0402FT2K21; Part Description: RES SMD 2.21K OHM 1% 1/16W 0402; Power (Watts): 0.063W, 1/16W; Temperature Coefficient: ±100ppm/°C; Value: 2.21k, 1%; Supplier 1: Digi-Key; Supplier Part Number 1: RMCF0402FT2K21CT-ND; Operating Temperature: -55°C ~ 155°C; Height: 0.016" (0.40mm); Tolerance: ±1%; Resistance (Ohms): 2.21k; Features: Automotive AEC-Q200; Package / Case: 0402 (1005 Metric); Packaging: Cut Tape (CT); Composition: Thick Film; Category: Resistors; Supplier Device Package: 0402; Number of Terminations: 2; RoHS: RoHS Compliant; Size / Dimension: 0.039" L x 0.020" W (1.00mm x 0.50mm)
R543 = Res_0402: Manufacturer: Vishay; Manufacturer Part Number 1: CRCW040247K0FKEDC; Part Description: 47 kOhms ±1% 0.063W, 1/16W Chip Resistor 0402 (1005 Metric)  Thick Film; Power Rating: 62.5mW; Resistance: 47kR; Temperature Coefficient: 100ppm/°C; Value: 47k, 1%; Supplier 1: Digi-Key; Supplier Part Number 1: 541-3966-1-ND; Stock 1: 799741; Pricing 1: 1=0.1, 10=0.032, 100=0.013, 1000=0.00583, 2500=0.00506, 5000=0.00418 (USD); Mount: Surface Mount; Case/Package: SMD/SMT; Contact Plating: Tin; Min Operating Temperature: -55°C; Max Operating Temperature: 155°C; Tolerance: 1%; Composition: Thick Film; Termination: Wraparound; Length: 1mm; Lead Free: Lead Free; ComponentLink1URL: http://www.vishay.com/docs/28773/crcwce3.pdf?src-supplier=Digi-Key; ComponentLink1Description: http://www.vishay.com/docs/28773/crcwce3.pdf?src-supplier=Digi-Key
R547 = Res_0402: Manufacturer: Yageo; Part Description: RES SMD 22K OHM 1% 1/16W 0402; Manufacturer Part Number 1: RC0402FR-0722KL; Temperature Coefficient: ±100ppm/°C; Power (Watts): 0.063W, 1/16W; Value: 22k, 1%; Number of Terminations: 2; Operating Temperature: -55°C ~ 155°C; Package / Case: 0402 (1005 Metric); Category: Resistors; Size / Dimension: 0.039" L x 0.020" W (1.00mm x 0.50mm); Height: 0.016" (0.40mm); Supplier 1: Digi-Key; Supplier Part Number 1: 311-22.0KLRCT-ND; RoHS: RoHS Compliant; Features: Moisture Resistant; Packaging: Cut Tape (CT); Composition: Thick Film; Supplier Device Package: 0402; Resistance (Ohms): 22k; Tolerance: ±1%
R551 = Res_0402: Manufacturer: Vishay Dale; Part Description: RES SMD 3K OHM 1% 1/16W 0402; Manufacturer Part Number 1: CRCW04023K00FKED; Temperature Coefficient: ±100ppm/°C; Power (Watts): 0.063W, 1/16W; Value: 3k, 1%; Category: Resistors; Tolerance: ±1%; RoHS: RoHS Compliant; Composition: Thick Film; Number of Terminations: 2; Operating Temperature: -55°C ~ 155°C; Supplier Device Package: 0402 (1005 Metric); Supplier Part Number 1: 541-3.00KLCT-ND; Packaging: Cut Tape (CT); Supplier 1: Digi-Key; Package / Case: 0402 (1005 Metric); Features: Automotive AEC-Q200; Resistance (Ohms): 3k; Height: 0.016" (0.40mm); Size / Dimension: 0.039" L x 0.020" W (1.00mm x 0.50mm)
TP7-TP13 = TESTPOINT_PAD: Test Point PCB mount Miniature White